# EAGLE design 21318 (EAGLE 7.6.0)
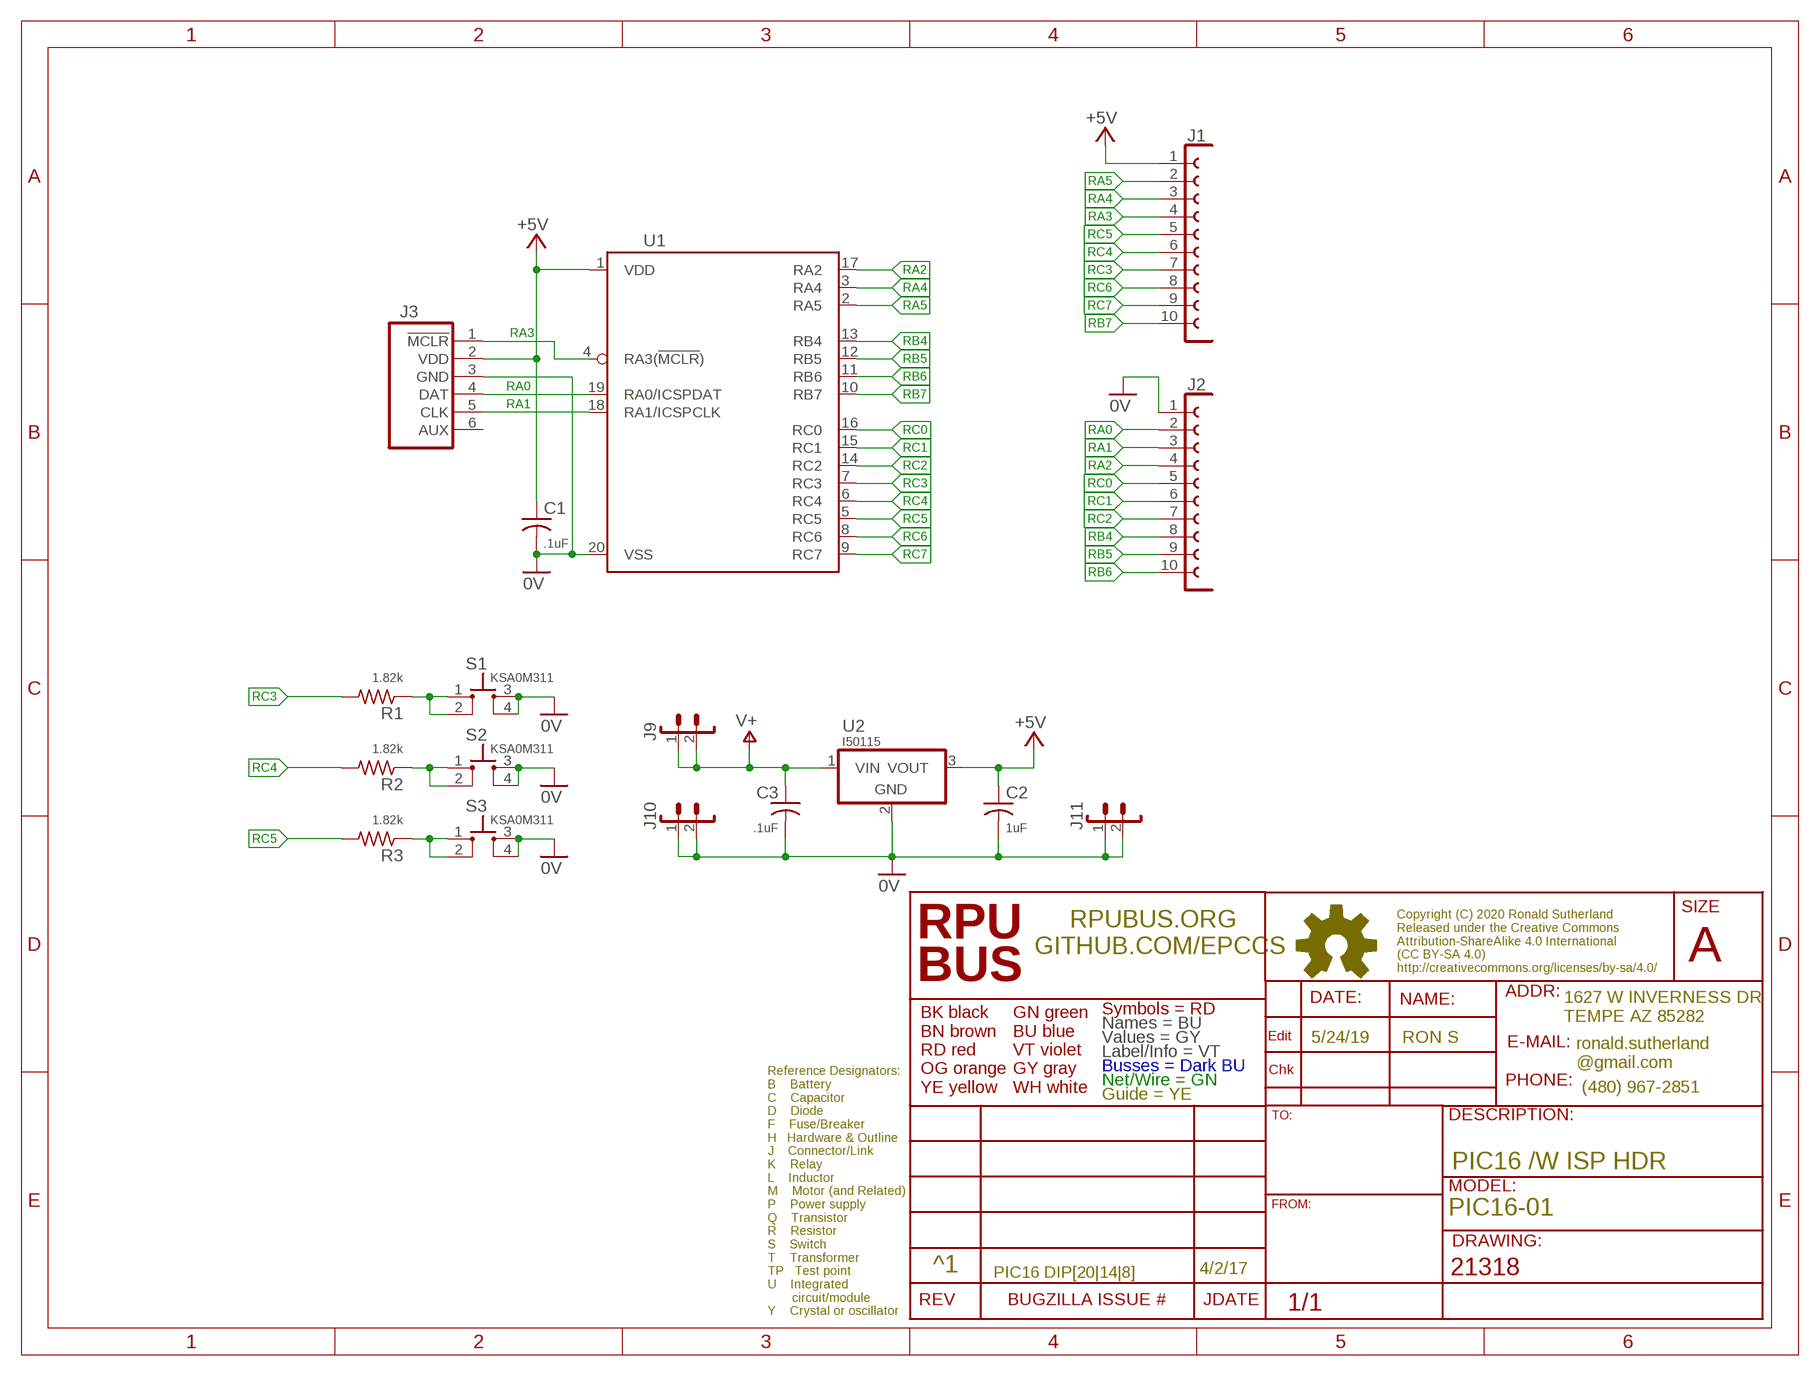
[diagram p0: schematic, sheet 1]

## Parts
C1  .1uF  CC0603A  [C0603(1608)]
C2  1uF  CC0805A  [C0805(2012)]
C3  .1uF  CC0603A  [C0603(1608)]
J1  F1X10  [F1X10]
J2  F1X10  [F1X10]
J3  ISP  [ISP]
J9  1X2  [1X2]
J10  1X2  [1X2]
J11  1X2  [1X2]
R1  1.82k  R0805  [C0805(2012)]
R2  1.82k  R0805  [C0805(2012)]
R3  1.82k  R0805  [C0805(2012)]
S1  KSA0M311  [0M311]
S2  KSA0M311  [0M311]
S3  KSA0M311  [0M311]
U1  PIC16F18346-I/P  [DIL20]
U2  I50115  OKI-78SR-H  [OKI-78SR-H]

## Nets
0V: C1.2 C2.2 C3.2 J2.1 J3.3(GND) J10.1 J10.2 J11.1 J11.2 S1.3 S1.4 S2.3 S2.4 S3.3 S3.4 U1.20(VSS) U2.2(GND)
+5V: C1.1 C2.1 J1.1 J3.2(VDD) U1.1(VDD) U2.3(VOUT)
N$1: R2.1 S2.1 S2.2
N$2: R3.1 S3.1 S3.2
N$93: R1.1 S1.1 S1.2
RA0: J2.2 J3.4(DAT) U1.19(RA0/ICSPDAT)
RA1: J2.3 J3.5(CLK) U1.18(RA1/ICSPCLK)
RA2: J2.4 U1.17(RA2)
RA3: J1.4 J3.1(!MCLR) U1.4(RA3(!MCLR!))
RA4: J1.3 U1.3(RA4)
RA5: J1.2 U1.2(RA5)
RB4: J2.8 U1.13(RB4)
RB5: J2.9 U1.12(RB5)
RB6: J2.10 U1.11(RB6)
RB7: J1.10 U1.10(RB7)
RC0: J2.5 U1.16(RC0)
RC1: J2.6 U1.15(RC1)
RC2: J2.7 U1.14(RC2)
RC3: J1.7 R1.2 U1.7(RC3)
RC4: J1.6 R2.2 U1.6(RC4)
RC5: J1.5 R3.2 U1.5(RC5)
RC6: J1.8 U1.8(RC6)
RC7: J1.9 U1.9(RC7)
V+: C3.1 J9.1 J9.2 U2.1(VIN)
Unconnected: J3.6(AUX)

## Notes on the sheet
- 5/24/19 | RON S
- PIC16 /W ISP HDR
- PIC16-01
- ^1 | 4/2/17
- PIC16 DIP[20|14|8]

## Library data of the parts
C1-C3 = C-C:C: CAPACITOR Symbol
J1 J2 = J-HDR2.54mm:F1X10: FEMALE HEADER 10POS
J3 = U-PIC:ISP
J9-J11 = J-HDR2.54mm:1X2
R1-R3 = R-C:R: Resiistor American-style symbol
S1-S3 = S-Tactile:KSA: KSA0M311 [C&K,KSA0M311LFT] SWITCH TACTILE SEALED SPST-NO 50MA 32V
U1 = U-PIC:PIC16F18346: PIC16F18346 MCU 16 Kword FLASH (e.g. 28KB program memory) 2k bytes SRAM 256 bytes EEPROM 1 EUSART 2 I2C slave 2 SPI (programing port) 32 MHz on chip oscillator 8 MIPS
U2 = P-DCDC:OKI-78SR: OKI-78SR OKI-78SR-5/1.5-W36H-C 5V@1.5A Horizontal Mount OKI-78SR-5/1.5-W36-C 5V@1.5A Vert Mount OKI-78SR-3.3/1.5-W36H-C 3.3V@1.5A Horizontal Mount OKI-78SR-3.3/1.5-W36-C 3.3V@1.5A Vert Mount Murata Power Solutions 7 to 36 VDC input range need to verify pinout

## Net classes
0 default: width 0.178 mm, drill 0.33 mm

## Board
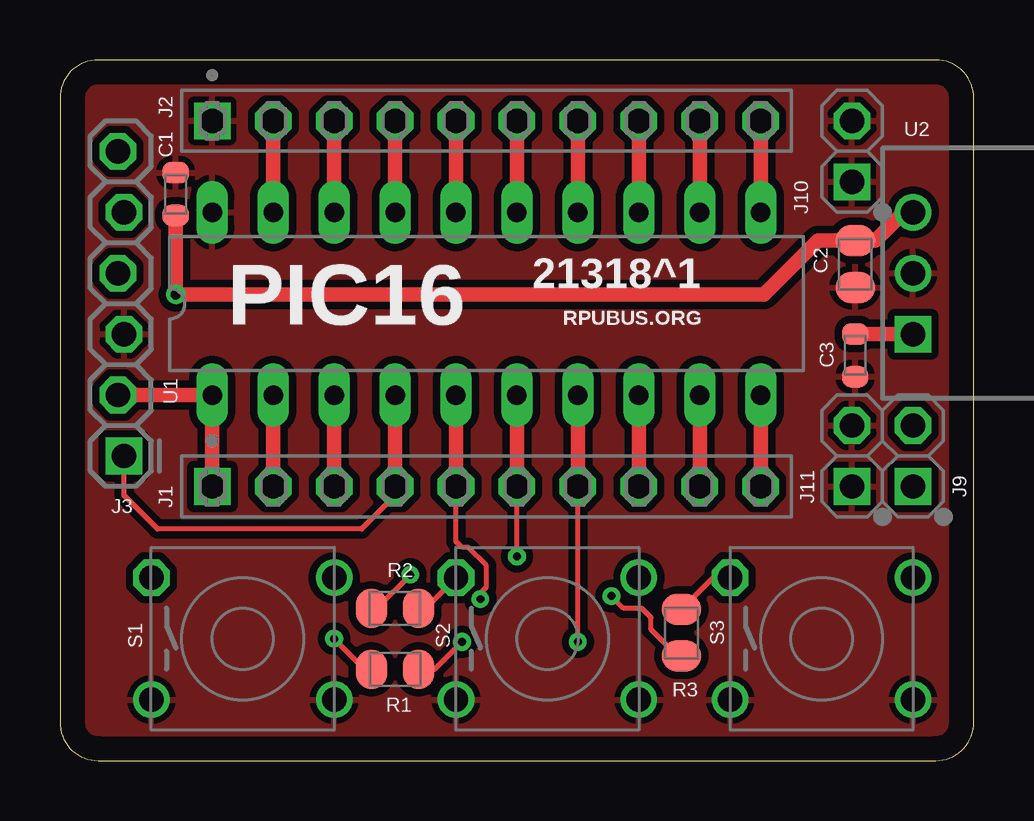
[diagram p1: board, top side]
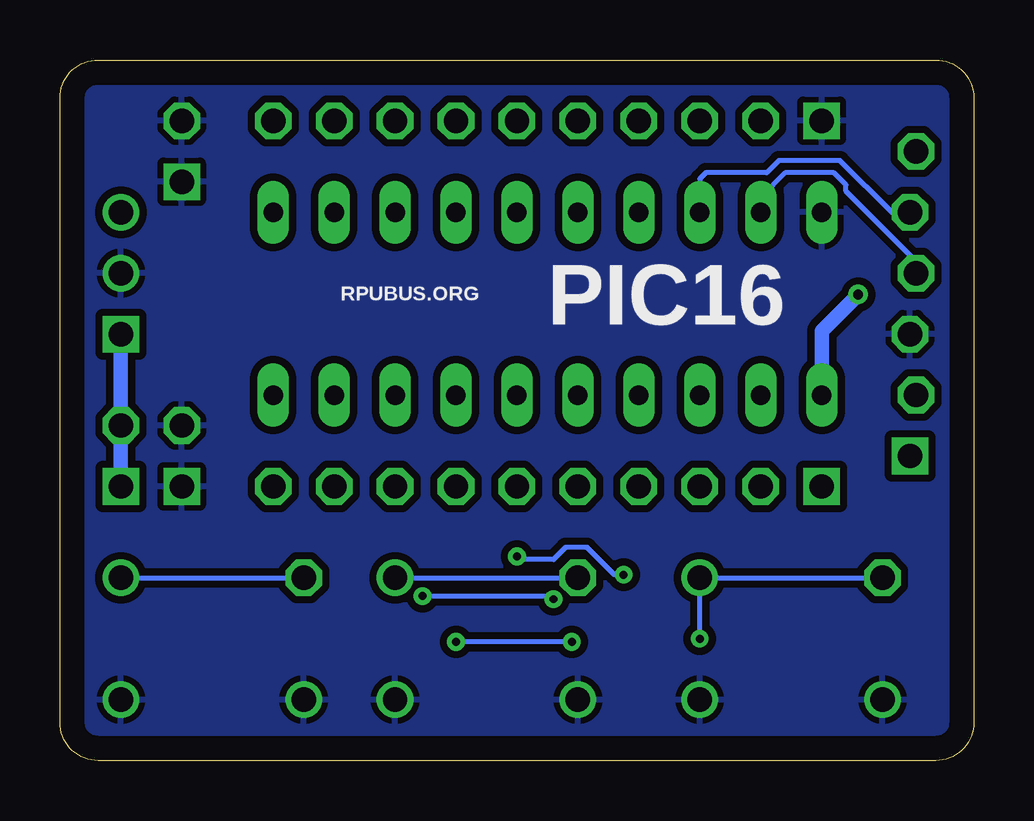
[diagram p2: board, bottom side, seen from below]

Size 38.1 x 29.21 mm. Coordinates in mm from the lower left corner, seen from the top.
Outline: 0,27.62 0,1.59 arc90 1.59,0 36.51,0 arc90 38.1,1.59 38.1,27.62 arc90 36.51,29.21 1.59,29.21 arc90 0,27.62
Copper layers (1*16): Top 0.035mm / dielectric 1.5mm / Bottom 0.035mm
Design rules "default *": minimum track width 10mil, minimum drill 13mil, track to track 10mil, track to pad 10mil, pad to pad 10mil, via to via 10mil, smd to smd 8mil, copper to edge 40mil, drill to drill 8mil, minimum pad ring 10mil, minimum via ring 8mil, stop-mask expansion 4mil, vias tented up to drill 17mil, thermal gap 10mil

### Footprints (pad centres in the part's own frame; a part is rotated, then mirrored left to right if it is on the bottom)
C0603(1608) = smd 0.898 x 1.1: 1 -0.889,0; 2 0.889,0
C0805(2012) = smd 1.321 x 1.651: 1 -0.977,0; 2 0.977,0
F1X10 = drill 1.016 square: 1 0,0 | drill 1.016 octagon: 2 2.54,0; 3 5.08,0; 4 7.62,0; 5 10.16,0; 6 12.7,0; 7 15.24,0; 8 17.78,0; 9 20.32,0; 10 22.86,0
ISP = drill 1.016 square: 1 0,-0.127 | drill 1.016 octagon: 2 2.54,0.127; 3 5.08,-0.127; 4 7.62,0.127; 5 10.16,-0.127; 6 12.7,0.127
1X2 = drill 1.016 square: 1 0,0 | drill 1.016 octagon: 2 2.54,0
0M311 = drill 1.016 octagon: 1 -3.81,2.54 | drill 1.016: 2 3.81,2.54; 3 -3.81,-2.54; 4 3.81,-2.54
DIL20 = drill 0.813 long: 1 -11.43,-3.81; 2 -8.89,-3.81; 3 -6.35,-3.81; 4 -3.81,-3.81; 5 -1.27,-3.81; 6 1.27,-3.81; 7 3.81,-3.81; 8 6.35,-3.81; 9 8.89,-3.81; 10 11.43,-3.81; 11 11.43,3.81; 12 8.89,3.81; 13 6.35,3.81; 14 3.81,3.81; 15 1.27,3.81; 16 -1.27,3.81; 17 -3.81,3.81; 18 -6.35,3.81; 19 -8.89,3.81; 20 -11.43,3.81
OKI-78SR-H = drill 1.016 square: 1 0,0 | drill 1.016: 2 -2.54,0; 3 -5.08,0

### Placement (x,y rotation side)
C1  4.83,23.62 90 top
C2  33.15,20.7 270 top
C3  33.15,16.89 270 top
J1  6.35,11.43 0 top
J2  6.35,26.67 0 top
J3  2.54,12.7 90 top
J9  35.56,11.43 90 top
J10  33.02,24.13 90 top
J11  33.02,11.43 90 top
R1  13.97,3.81 0 top
R2  13.97,6.35 180 top
R3  25.91,5.33 270 top
S1  7.62,5.08 0 top
S2  20.32,5.08 0 top
S3  31.75,5.08 0 top
U1  17.78,19.05 0 top
U2  35.56,17.78 270 top

### Tracks (layer width: path | path; a pad name or v marks a point on that pad's centre or on a via)
0V
  pour Bottom (isolate 0.305): 0,29.21 38.1,29.21 38.1,0 0,0
  pour Top (isolate 0.305): 0,29.21 38.1,29.21 38.1,0 0,0
+5V  (via drill 0.41)
  Top 0.61: J1.1 U1.1 J3.2 | C1.1 v4.83,19.43 29.34,19.43 31.58,21.68 C2.1 34,21.68 35.18,22.86 U2.3
  Bottom 0.61: U1.1 6.35,17.91 v4.83,19.43
N$1
  Top 0.203: R2.1 15.24,6.35 S2.1
  Bottom 0.203: S2.2 S2.1
N$2
  Top 0.203: S3.1 27.22,7.62 R3.1
  Bottom 0.203: S3.2 S3.1
N$93  (via drill 0.33)
  Top 0.203: R1.1 12.7,3.81 v11.43,5.08
  Bottom 0.203: S1.1 S1.2 v11.43,5.08
RA0
  Top 0.61: U1.19 J2.2
  Bottom 0.203: J3.4 2.41,20.83 5.33,23.75 5.33,24 5.84,24.51 7.87,24.51 8.89,23.5 U1.19
RA1
  Top 0.61: U1.18 J2.3
  Bottom 0.203: J3.5 3.43,22.86 5.59,25.02 8.13,25.02 8.64,24.51 11.18,24.51 11.43,24.26 U1.18
RA2
  Top 0.61: U1.17 J2.4
RA3
  Top 0.203: J1.4 13.97,11.05 12.57,9.65 4.06,9.65 2.67,11.05 J3.1
  Top 0.61: U1.4 J1.4
RA4
  Top 0.61: U1.3 J1.3
RA5
  Top 0.61: U1.2 J1.2
RB4
  Top 0.61: U1.13 J2.8
RB5
  Top 0.61: U1.12 J2.9
RB6
  Top 0.61: U1.11 J2.10
RB7
  Top 0.61: U1.10 J1.10
RC0
  Top 0.61: U1.16 J2.5
RC1
  Top 0.61: U1.15 J2.6
RC2
  Top 0.61: U1.14 J2.7
RC3  (via drill 0.33)
  Top 0.203: R1.2 15.62,3.81 v16.76,4.95 | v21.59,4.95 J1.7
  Top 0.61: U1.7 J1.7
  Bottom 0.203: v16.76,4.95 v21.59,4.95
RC4  (via drill 0.33)
  Top 0.203: R2.2 13.21,6.35 v14.61,7.75 | v19.05,8.51 J1.6
  Top 0.61: U1.6 J1.6
  Bottom 0.203: v14.61,7.75 14.99,7.75 16.13,8.89 17.02,8.89 17.53,8.38 18.92,8.38 v19.05,8.51
RC5  (via drill 0.33)
  Top 0.203: R3.2 25.74,4.36 24.64,5.46 24.64,5.97 24.26,6.35 23.5,6.35 v22.99,6.86 | v17.53,6.73 17.53,6.99 17.78,7.24 17.78,8.13 17.02,8.89 16.76,8.89 16.51,9.14 J1.5
  Top 0.61: U1.5 J1.5
  Bottom 0.203: v22.99,6.86 17.65,6.86 v17.53,6.73
RC6
  Top 0.61: U1.8 J1.8
RC7
  Top 0.61: U1.9 J1.9
V+
  Top 0.61: C3.1 U2.1
  Bottom 0.61: U2.1 J9.2 J9.1

### Text on the board
tPlace: 21318^1 | PIC16 | RPUBUS.ORG
bPlace: RPUBUS.ORG | PIC16